# EAGLE design module (EAGLE 9.6.2)

## Sheet 1 of 3
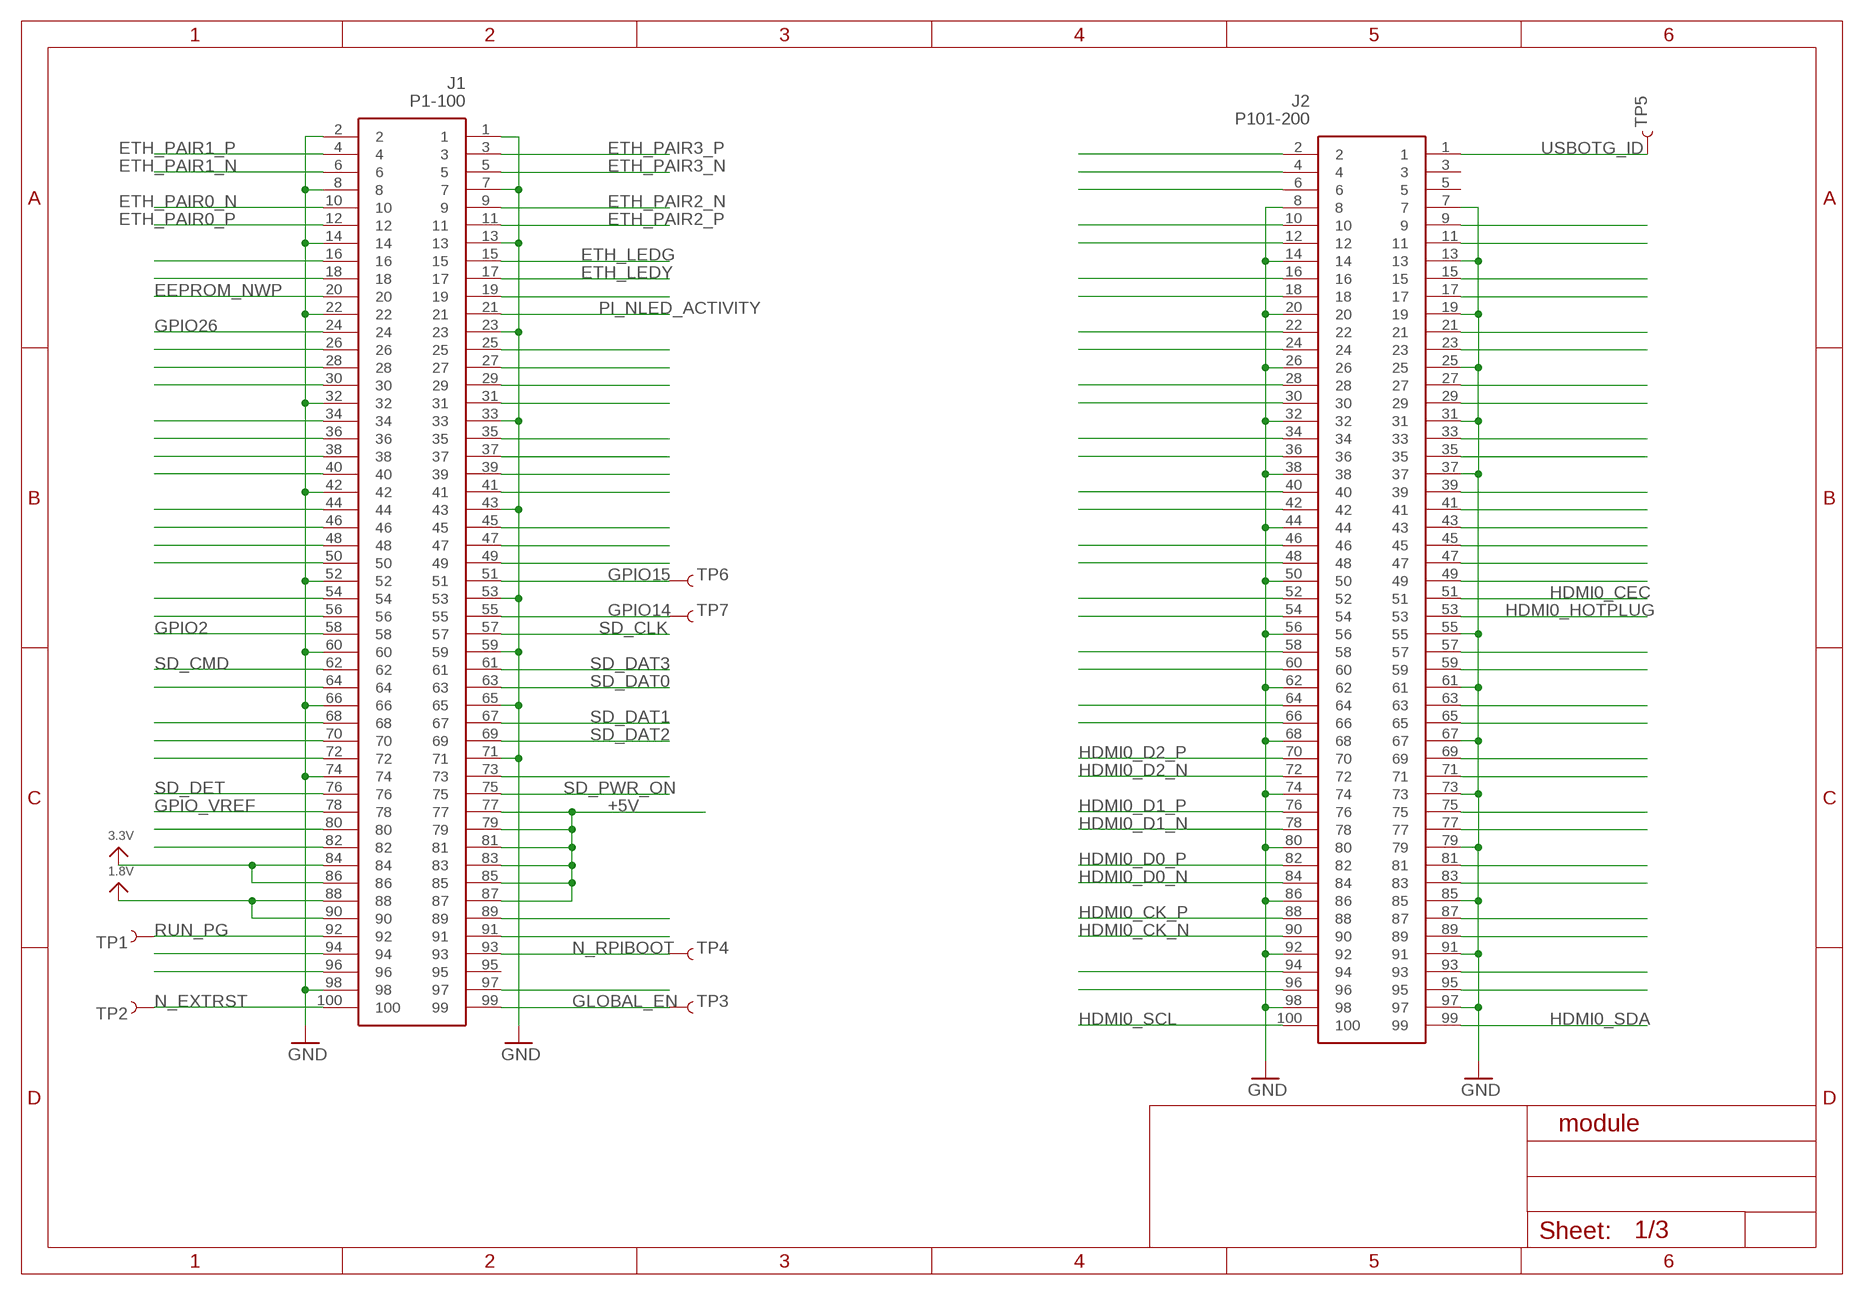
[diagram p0: schematic, sheet 1]

### Parts
J1  P1-100  DF40C-100DS-0.4V_51_  [DF40C100DS04V51]
J2  P101-200  DF40C-100DS-0.4V_51_  [DF40C100DS04V51]
TP1  TEST-POINT3X5  [PAD.03X.05]
TP2  TEST-POINT3X5  [PAD.03X.05]
TP3  TEST-POINT3X5  [PAD.03X.05]
TP4  TEST-POINT3X5  [PAD.03X.05]
TP5  TEST-POINT3X5  [PAD.03X.05]
TP6  TEST-POINT3X5  [PAD.03X.05]
TP7  TEST-POINT3X5  [PAD.03X.05]

### Nets
1.8V: J1.88 J1.90
3.3V: J1.84 J1.86
+5V: J1.77 J1.79 J1.81 J1.83 J1.85 J1.87
EEPROM_NWP: J1.20
ETH_LEDG: J1.15
ETH_LEDY: J1.17
ETH_PAIR0_N: J1.10
ETH_PAIR0_P: J1.12
ETH_PAIR1_N: J1.6
ETH_PAIR1_P: J1.4
ETH_PAIR2_N: J1.9
ETH_PAIR2_P: J1.11
ETH_PAIR3_N: J1.5
ETH_PAIR3_P: J1.3
GLOBAL_EN: J1.99 TP3.P$1
GND: J1.1 J1.2 J1.7 J1.8 J1.13 J1.14 J1.22 J1.23 J1.32 J1.33 J1.42 J1.43 J1.52 J1.53 J1.59 J1.60 J1.65 J1.66 J1.71 J1.74 J1.98 J2.7 J2.8 J2.13 J2.14 J2.19 J2.20 J2.25 J2.26 J2.31 J2.32 J2.37 J2.38 J2.44 J2.50 J2.55 J2.56 J2.61 J2.62 J2.67 J2.68 J2.73 J2.74 J2.79 J2.80 J2.85 J2.86 J2.91 J2.92 J2.97 J2.98
GPIO2: J1.58
GPIO14: J1.55 TP7.P$1
GPIO15: J1.51 TP6.P$1
GPIO26: J1.24
GPIO_VREF: J1.78
HDMI0_CEC: J2.51
HDMI0_CK_N: J2.90
HDMI0_CK_P: J2.88
HDMI0_D0_N: J2.84
HDMI0_D0_P: J2.82
HDMI0_D1_N: J2.78
HDMI0_D1_P: J2.76
HDMI0_D2_N: J2.72
HDMI0_D2_P: J2.70
HDMI0_HOTPLUG: J2.53
HDMI0_SCL: J2.100
HDMI0_SDA: J2.99
N$3: J2.2
N$5: J2.4
N$7: J2.6
N$10: J2.9
N$11: J2.10
N$12: J2.11
N$13: J2.12
N$16: J1.16
N$17: J2.15
N$18: J1.18
N$19: J1.19
N$20: J2.16
N$21: J2.17
N$22: J2.18
N$25: J1.25
N$26: J1.26
N$27: J1.27
N$28: J1.28
N$29: J1.29
N$30: J1.30
N$31: J1.31
N$32: J2.21
N$33: J2.22
N$34: J1.34
N$35: J1.35
N$36: J1.36
N$37: J1.37
N$38: J1.38
N$39: J1.39
N$40: J1.40
N$41: J1.41
N$42: J2.23
N$43: J2.24
N$44: J1.44
N$45: J1.45
N$46: J1.46
N$47: J1.47
N$48: J1.48
N$49: J1.49
N$50: J1.50
N$54: J1.54
N$56: J1.56
N$57: J2.27
N$58: J2.28
N$59: J2.29
N$60: J2.30
N$63: J2.33
N$64: J1.64
N$65: J2.34
N$66: J2.35
N$67: J2.36
N$68: J1.68
N$70: J1.70
N$72: J1.72
N$73: J1.73
N$74: J2.39
N$75: J2.40
N$76: J2.41
N$77: J2.42
N$78: J2.43
N$80: J1.80
N$81: J2.45
N$82: J1.82
N$83: J2.46
N$84: J2.47
N$85: J2.48
N$86: J2.49
N$89: J1.89
N$90: J2.52
N$91: J1.91
N$93: J2.54
N$94: J1.94
N$96: J1.96
N$97: J1.97
N$99: J2.57
N$100: J2.58
N$101: J2.59
N$102: J2.60
N$105: J2.63
N$106: J2.64
N$107: J2.65
N$108: J2.66
N$111: J2.69
N$113: J2.71
N$117: J2.75
N$119: J2.77
N$123: J2.81
N$125: J2.83
N$129: J2.87
N$131: J2.89
N$135: J2.93
N$136: J2.94
N$137: J2.95
N$138: J2.96
N_EXTRST: J1.100 TP2.P$1
N_RPIBOOT: J1.93 TP4.P$1
PI_NLED_ACTIVITY: J1.21
RUN_PG: J1.92 TP1.P$1
SD_CLK: J1.57
SD_CMD: J1.62
SD_DAT0: J1.63
SD_DAT1: J1.67
SD_DAT2: J1.69
SD_DAT3: J1.61
SD_DET: J1.76
SD_PWR_ON: J1.75
USBOTG_ID: J2.1 TP5.P$1
Unconnected: J1.95 J2.3 J2.5

## Sheet 2 of 3
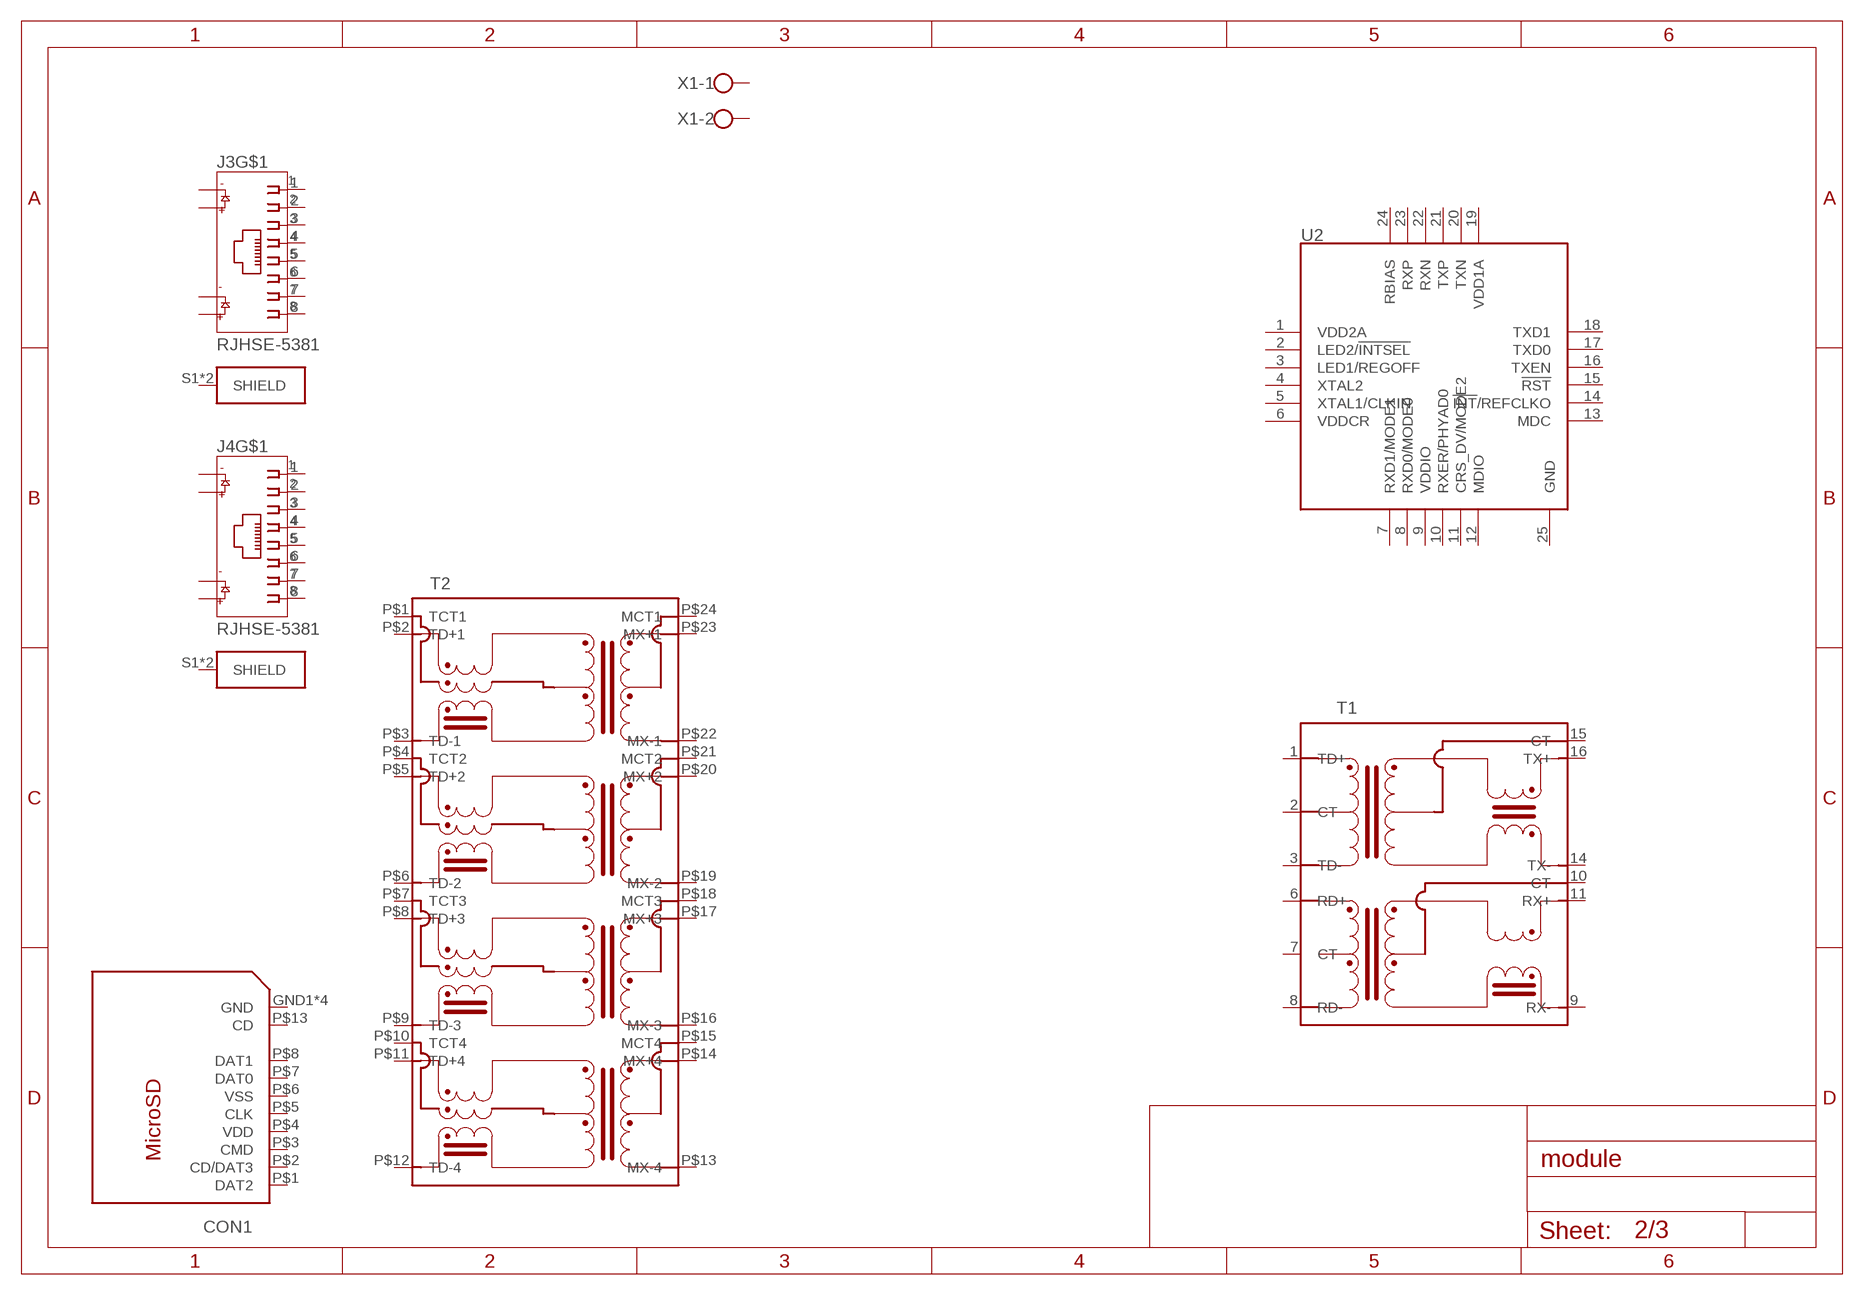
[diagram p1: schematic, sheet 2]

### Parts
CON1  112J-TXAR  [112J]
J3  RJHSE-5381  [AMPHENOL_RJHSE-5381]
J4  RJHSE-5381  [AMPHENOL_RJHSE-5381]
T1  PT61017PEL  [PT61017]
T2  SM51625  [SM61625EL]
U2  LAN8720A  [QFN50P400X400X100-25T250N]
X1  W237-102  [EBBA]
Unconnected: CON1.GND1(GND) CON1.GND2(GND) CON1.GND3(GND) CON1.GND4(GND) CON1.P$1(DAT2) CON1.P$2(CD/DAT3) CON1.P$3(CMD) CON1.P$4(VDD) CON1.P$5(CLK) CON1.P$6(VSS) CON1.P$7(DAT0) CON1.P$8(DAT1) CON1.P$13(CD) J3.1 J3.2 J3.3 J3.4 J3.5 J3.6 J3.7 J3.8 J3.9 J3.10 J3.11 J3.12 J3.S1(SHIELD) J3.S2(SHIELD) J4.1 J4.2 J4.3 J4.4 J4.5 J4.6 J4.7 J4.8 J4.9 J4.10 J4.11 J4.12 J4.S1(SHIELD) J4.S2(SHIELD) T1.1(TD+) T1.2(CT) T1.3(TD-) T1.6(RD+) T1.7(CT) T1.8(RD-) T1.9(RX-) T1.10(CT) T1.11(RX+) T1.14(TX-) T1.15(CT) T1.16(TX+) T2.P$1(TCT1) T2.P$2(TD+1) T2.P$3(TD-1) T2.P$4(TCT2) T2.P$5(TD+2) T2.P$6(TD-2) T2.P$7(TCT3) T2.P$8(TD+3) T2.P$9(TD-3) T2.P$10(TCT4) T2.P$11(TD+4) T2.P$12(TD-4) T2.P$13(MX-4) T2.P$14(MX+4) T2.P$15(MCT4) T2.P$16(MX-3) T2.P$17(MX+3) T2.P$18(MCT3) T2.P$19(MX-2) T2.P$20(MX+2) T2.P$21(MCT2) T2.P$22(MX-1) T2.P$23(MX+1) T2.P$24(MCT1) U2.1(VDD2A) U2.2(LED2/!INTSEL) U2.3(LED1/REGOFF) U2.4(XTAL2) U2.5(XTAL1/CLKIN) U2.6(VDDCR) U2.7(RXD1/MODE1) U2.8(RXD0/MODE0) U2.9(VDDIO) U2.10(RXER/PHYAD0) U2.11(CRS_DV/MODE2) U2.12(MDIO) U2.13(MDC) U2.14(!INT!/REFCLKO) U2.15(!RST) U2.16(TXEN) U2.17(TXD0) U2.18(TXD1) U2.19(VDD1A) U2.20(TXN) U2.21(TXP) U2.22(RXN) U2.23(RXP) U2.24(RBIAS) U2.25(GND) X1.1 X1.2

## Sheet 3 of 3
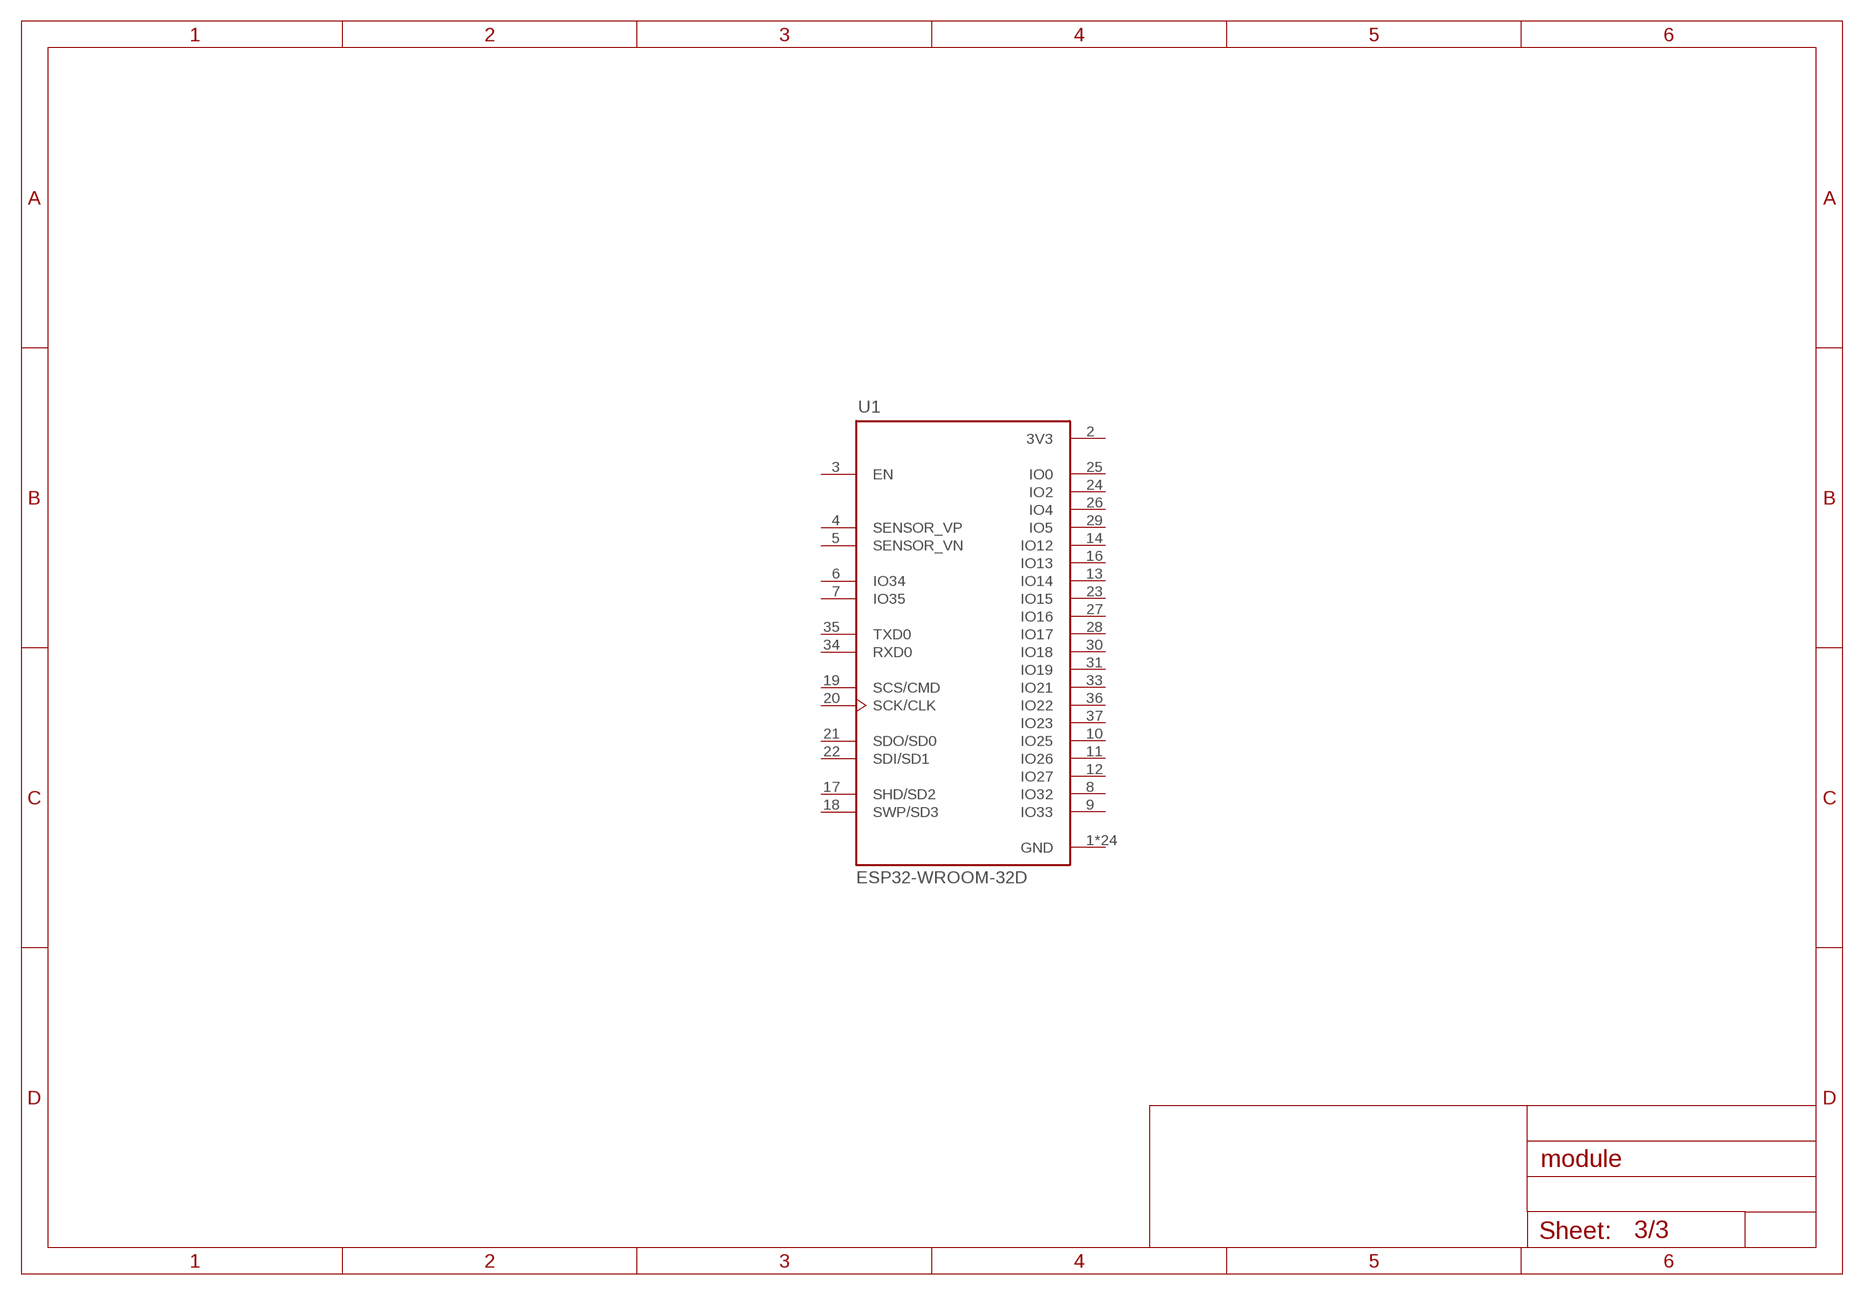
[diagram p2: schematic, sheet 3]

### Parts
U1  ESP32-WROOM-32D  [MODULE_ESP32-WROOM-32D]
Unconnected: U1.3(EN) U1.4(SENSOR_VP) U1.5(SENSOR_VN) U1.6(IO34) U1.7(IO35) U1.8(IO32) U1.9(IO33) U1.10(IO25) U1.11(IO26) U1.12(IO27) U1.13(IO14) U1.14(IO12) U1.16(IO13) U1.17(SHD/SD2) U1.18(SWP/SD3) U1.19(SCS/CMD) U1.20(SCK/CLK) U1.21(SDO/SD0) U1.22(SDI/SD1) U1.23(IO15) U1.24(IO2) U1.25(IO0) U1.26(IO4) U1.27(IO16) U1.28(IO17) U1.29(IO5) U1.30(IO18) U1.31(IO19) U1.33(IO21) U1.34(RXD0) U1.35(TXD0) U1.36(IO22) U1.37(IO23)

## Power pins joined to a net without a drawn wire
3V3: U1.2(3V3)
GND: U1.1(GND) U1.15(GND) U1.38(GND) U1.39_1(GND) U1.39_2(GND) U1.39_3(GND) U1.39_4(GND) U1.39_5(GND) U1.39_6(GND) U1.39_7(GND) U1.39_8(GND) U1.39_9(GND) U1.39_10(GND) U1.39_11(GND) U1.39_12(GND) U1.39_13(GND) U1.39_14(GND) U1.39_15(GND) U1.39_16(GND) U1.39_17(GND) U1.39_18(GND) U1.39_19(GND) U1.39_20(GND) U1.39_21(GND)

## Library data of the parts
CON1 = parts-attend:112J-TXAR
J1 J2 = SamacSys_Parts:DF40C-100DS-0.4V_51_: HIROSE(HRS) - DF40C-100DS-0.4V(51) - CONNECTOR, STACKING, RCPT, 100POS, 2ROW Source: Datasheet <https://www.hirose.com/product/en/download_file/key_name/DF40C-100DS-0.4V(51)/category/Drawing (2D)/doc_file_id/46856/?file_category_id=6&item_id=06844033451&is_series=>; DESCRIPTION: HIROSE(HRS) - DF40C-100DS-0.4V(51) - CONNECTOR, STACKING, RCPT, 100POS, 2ROW; HEIGHT: 1.65mm; MANUFACTURER_NAME: Hirose; MANUFACTURER_PART_NUMBER: DF40C-100DS-0.4V(51); MOUSER_PART_NUMBER: 798-DF40C100DS0.4V51; MOUSER_PRICE-STOCK: https://www.mouser.co.uk/ProductDetail/Hirose-Connector/DF40C-100DS-04V51?qs=eDUdFcBPps2MEwbnuPvZzQ%3D%3D
J3 J4 = parts-amphenol:RJHSE-5381: connector, mod jack, rt angle pcb, shielded, led1-g, led2-y, single port, rj-45 8 cont; AVAILABILITY: Unavailable; DESCRIPTION: connector, mod jack, rt angle pcb, shielded, led1-g, led2-y, single port, rj-45 8 cont; MF: Amphenol ICC; MP: RJHSE-5381; PACKAGE: None; PRICE: None
T1 = parts-bourns:PT61017PEL
T2 = parts-bourns:SM51625
TP1-TP7 = SparkFun-Connectors:TEST-POINT: SparkFun Test Points Bare copper test points for troubleshooting or In-Circuit-Testing. These are used by our Production team for verifying production board runs using pogo-pins on test beds. SparkFun Products: SparkFun LSM9DS1 Breakout <https://www.sparkfun.com/products/13284> SparkFun PSOC <https://www.sparkfun.com/products/13714> SparkFun Load Cell Amplifier <https://www.sparkfun.com/products/13879>
U1 = parts-espressif:ESP32-WROOM-32D: Bluetooth, WiFi 802.11b/g/n, Bluetooth v4.2 + EDR, Class 1, 2 and 3 Transceiver Module 2.4GHz ~ 2.5GHz Integrated, Trace Surface Mount Check prices <https://pricing.snapeda.com/parts/ESP32-WROOM-32D/Espressif%20Systems/view-part?ref=eda>; AVAILABILITY: Bad; DESCRIPTION: 802.11b/g/n, Bluetooth v4.2 +EDR, Class 1, 2 and 3 Transceiver Module 2.4GHz ~ 2.5GHz Integrated, Trace Surface Mount; MF: Espressif Systems; MP: ESP32-WROOM-32D; PACKAGE: Module Espressif Systems; PRICE: None
U2 = parts-microchip:LAN8720A
X1 = parts-adam_tech:W237-102: WAGO SCREW CLAMP

## Board
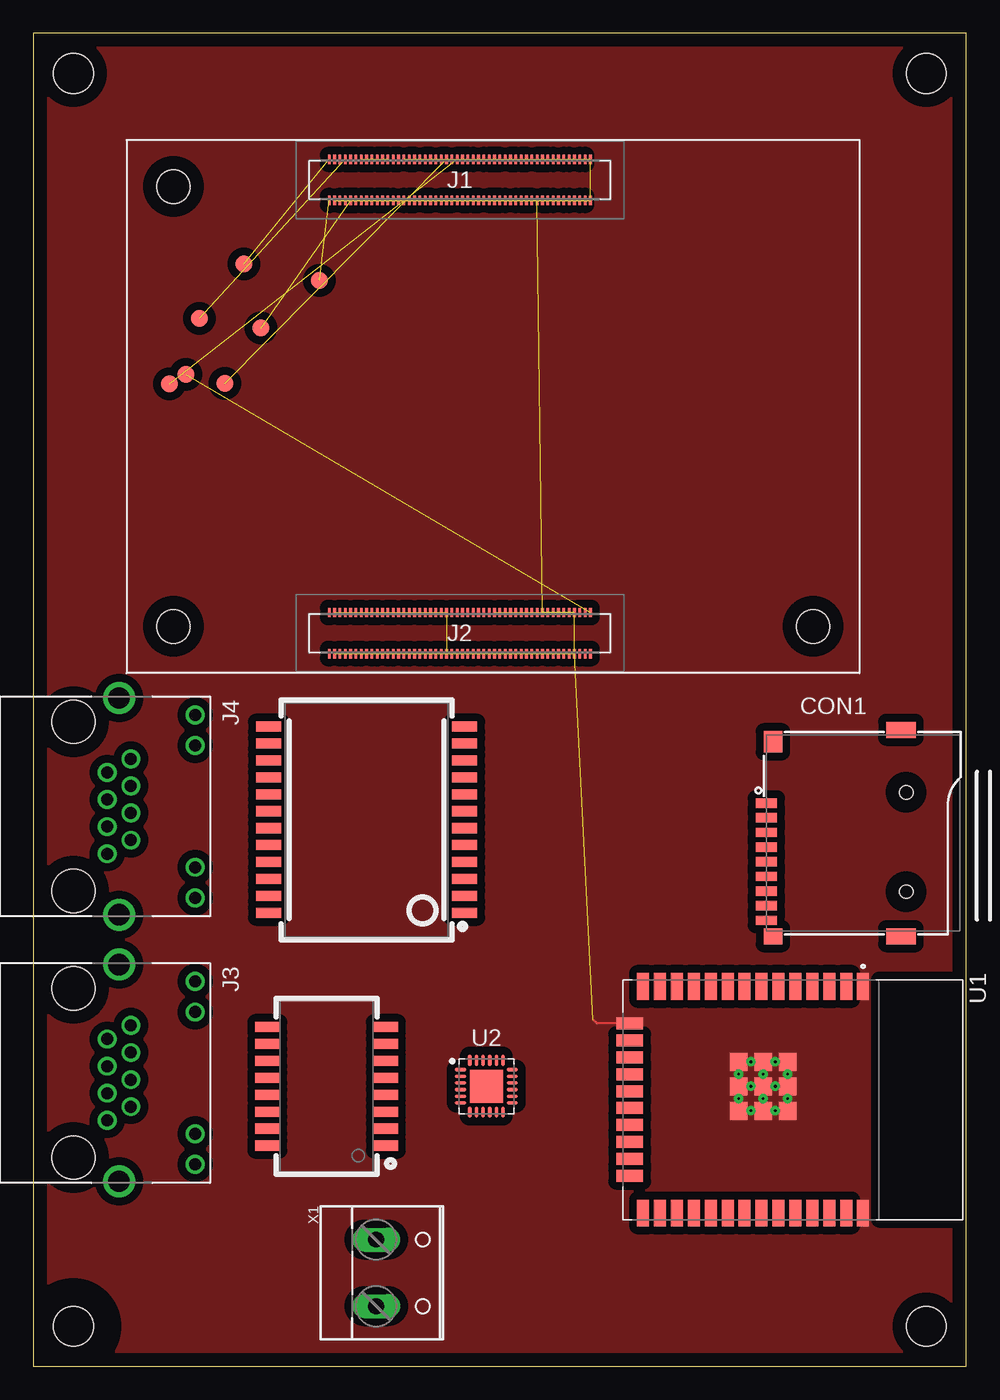
[diagram p3: board, top side]

Size 70 x 100 mm. Coordinates in mm from the lower left corner, seen from the top.
Outline: 0,0 70,0 70,100 0,100 0,0
Copper layers (1*16): Top 0.035mm / dielectric 1.5mm / Bottom 0.035mm
Design rules "default": minimum track width 6mil, minimum drill 0.35mm, track to track 6mil, track to pad 6mil, pad to pad 6mil, via to via 6mil, smd to smd 6mil, copper to edge 40mil, drill to drill 6mil, minimum pad ring 10mil, minimum via ring 8mil, stop-mask expansion 4mil, vias tented up to drill 0mil, thermal gap 10mil
Holes 2.5 mm at 10.5,55.5 10.5,88.5 58.5,55.5
Holes 3 mm at 3,3 3,97 67,3 67,97
tRestrict: area 0,0 to 6,6

### Footprints (pad centres in the part's own frame; a part is rotated, then mirrored left to right if it is on the bottom)
112J = smd 1.2 x 1.4: GND1 -7.75,-0.5 | smd 1.2 x 2.2: GND2 -7.75,-10.1; GND3 7.75,-10.1 | smd 1.6 x 1.4: GND4 6.85,-0.5 | smd 0.7 x 1.6: P$1 2.25,0; P$2 1.15,0; P$3 0.05,0; P$4 -1.05,0; P$5 -2.15,0; P$6 -3.25,0; P$7 -4.35,0; P$8 -5.45,0; P$13 -6.55,0 | hole 1: -4.4,-10.5; 3.05,-10.5
DF40C100DS04V51 = smd 0.2 x 0.7: 1 -9.8,-1.54; 2 -9.8,1.54; 3 -9.4,-1.54; 4 -9.4,1.54; 5 -9,-1.54; 6 -9,1.54; 7 -8.6,-1.54; 8 -8.6,1.54; 9 -8.2,-1.54; 10 -8.2,1.54; 11 -7.8,-1.54; 12 -7.8,1.54; 13 -7.4,-1.54; 14 -7.4,1.54; 15 -7,-1.54; 16 -7,1.54; 17 -6.6,-1.54; 18 -6.6,1.54; 19 -6.2,-1.54; 20 -6.2,1.54; 21 -5.8,-1.54; 22 -5.8,1.54; 23 -5.4,-1.54; 24 -5.4,1.54; 25 -5,-1.54; 26 -5,1.54; 27 -4.6,-1.54; 28 -4.6,1.54; 29 -4.2,-1.54; 30 -4.2,1.54; 31 -3.8,-1.54; 32 -3.8,1.54; 33 -3.4,-1.54; 34 -3.4,1.54; 35 -3,-1.54; 36 -3,1.54; 37 -2.6,-1.54; 38 -2.6,1.54; 39 -2.2,-1.54; 40 -2.2,1.54; 41 -1.8,-1.54; 42 -1.8,1.54; 43 -1.4,-1.54; 44 -1.4,1.54; 45 -1,-1.54; 46 -1,1.54; 47 -0.6,-1.54; 48 -0.6,1.54; 49 -0.2,-1.54; 50 -0.2,1.54; 51 0.2,-1.54; 52 0.2,1.54; 53 0.6,-1.54; 54 0.6,1.54; 55 1,-1.54; 56 1,1.54; 57 1.4,-1.54; 58 1.4,1.54; 59 1.8,-1.54; 60 1.8,1.54; 61 2.2,-1.54; 62 2.2,1.54; 63 2.6,-1.54; 64 2.6,1.54; 65 3,-1.54; 66 3,1.54; 67 3.4,-1.54; 68 3.4,1.54; 69 3.8,-1.54; 70 3.8,1.54; 71 4.2,-1.54; 72 4.2,1.54; 73 4.6,-1.54; 74 4.6,1.54; 75 5,-1.54; 76 5,1.54; 77 5.4,-1.54; 78 5.4,1.54; 79 5.8,-1.54; 80 5.8,1.54; 81 6.2,-1.54; 82 6.2,1.54; 83 6.6,-1.54; 84 6.6,1.54; 85 7,-1.54; 86 7,1.54; 87 7.4,-1.54; 88 7.4,1.54; 89 7.8,-1.54; 90 7.8,1.54; 91 8.2,-1.54; 92 8.2,1.54; 93 8.6,-1.54; 94 8.6,1.54; 95 9,-1.54; 96 9,1.54; 97 9.4,-1.54; 98 9.4,1.54; 99 9.8,-1.54; 100 9.8,1.54
AMPHENOL_RJHSE-5381 = drill 0.9: 1 3.55,2.54; 2 2.53,4.32; 3 1.52,2.54; 4 0.5,4.32; 5 -0.51,2.54; 6 -1.53,4.32; 7 -2.54,2.54; 8 -3.56,4.32; 9 6.86,9.14; 10 4.57,9.14; 11 -4.57,9.14; 12 -6.86,9.14 | drill 1.6: S1 8.13,3.43; S2 -8.13,3.43 | hole 3.25: 6.35,0; -6.35,0
PT61017 = smd 0.76 x 1.8: 1 -4.445,-4.45; 2 -3.175,-4.45; 3 -1.905,-4.45; 4 -0.635,-4.45; 5 0.635,-4.45; 6 1.905,-4.45; 7 3.175,-4.45; 8 4.445,-4.45; 9 4.445,4.45; 10 3.175,4.45; 11 1.905,4.45; 12 0.635,4.45; 13 -0.635,4.45; 14 -1.905,4.45; 15 -3.175,4.45; 16 -4.445,4.45
SM61625EL = smd 0.76 x 1.9: P$1 -6.985,-7.35; P$2 -5.715,-7.35; P$3 -4.445,-7.35; P$4 -3.175,-7.35; P$5 -1.905,-7.35; P$6 -0.635,-7.35; P$7 0.635,-7.35; P$8 1.905,-7.35; P$9 3.175,-7.35; P$10 4.445,-7.35; P$11 5.715,-7.35; P$12 6.985,-7.35; P$13 6.985,7.35; P$14 5.715,7.35; P$15 4.445,7.35; P$16 3.175,7.35; P$17 1.905,7.35; P$18 0.635,7.35; P$19 -0.635,7.35; P$20 -1.905,7.35; P$21 -3.175,7.35; P$22 -4.445,7.35; P$23 -5.715,7.35; P$24 -6.985,7.35
PAD.03X.05 = smd 1.27 x 1.27: P$1 0,0
MODULE_ESP32-WROOM-32D = smd 2 x 0.9: 1 -8.5,5.26; 2 -8.5,3.99; 3 -8.5,2.72; 4 -8.5,1.45; 5 -8.5,0.18; 6 -8.5,-1.09; 7 -8.5,-2.36; 8 -8.5,-3.63; 9 -8.5,-4.9; 10 -8.5,-6.17; 11 -8.5,-7.44; 12 -8.5,-8.71; 13 -8.5,-9.98; 14 -8.5,-11.25; 25 8.5,-11.25; 26 8.5,-9.98; 27 8.5,-8.71; 28 8.5,-7.44; 29 8.5,-6.17; 30 8.5,-4.9; 31 8.5,-3.63; 32 8.5,-2.36; 33 8.5,-1.09; 34 8.5,0.18; 35 8.5,1.45; 36 8.5,2.72; 37 8.5,3.99; 38 8.5,5.26 | smd 0.9 x 2: 15 -5.715,-12.25; 16 -4.445,-12.25; 17 -3.175,-12.25; 18 -1.905,-12.25; 19 -0.635,-12.25; 20 0.635,-12.25; 21 1.905,-12.25; 22 3.175,-12.25; 23 4.445,-12.25; 24 5.715,-12.25 | smd 1.33 x 1.33: 39_1 -2.835,-0.405; 39_2 -1,-0.405; 39_3 0.835,-0.405; 39_4 -2.835,-2.24; 39_5 -1,-2.24; 39_6 0.835,-2.24; 39_7 -2.835,-4.075; 39_8 -1,-4.075; 39_9 0.835,-4.075 | drill 0.2 pad 0.3: 39_10 -1.917,-0.405; 39_11 -0.083,-0.405; 39_12 -2.835,-1.323; 39_13 -1,-1.323; 39_14 0.835,-1.323; 39_15 -1.917,-2.24; 39_16 -0.083,-2.24; 39_17 -2.835,-3.158; 39_18 -1,-3.158; 39_19 0.835,-3.158; 39_20 -1.917,-4.075; 39_21 -0.083,-4.075
QFN50P400X400X100-25T250N = smd 0.838 x 0.264: 1 -1.946,1.25; 2 -1.946,0.75; 3 -1.946,0.25; 4 -1.946,-0.25; 5 -1.946,-0.75; 6 -1.946,-1.25; 13 1.946,-1.25; 14 1.946,-0.75; 15 1.946,-0.25; 16 1.946,0.25; 17 1.946,0.75; 18 1.946,1.25 | smd 0.264 x 0.838: 7 -1.25,-1.946; 8 -0.75,-1.946; 9 -0.25,-1.946; 10 0.25,-1.946; 11 0.75,-1.946; 12 1.25,-1.946; 19 1.25,1.946; 20 0.75,1.946; 21 0.25,1.946; 22 -0.25,1.946; 23 -0.75,1.946; 24 -1.25,1.946 | smd 2.5 x 2.5: 25 0,0
EBBA = drill 1.194 long: 1 -2.5,-1.27; 2 2.5,-1.27

### Placement (x,y rotation side)
CON1  55,40 90 top
J1  32,89 180 top
J2  32,55 180 top
J3  3,22 270 top
J4  3,42 270 top
T1  22,21 90 top
T2  25,41 90 top
TP1  17.08,77.89 0 top
TP2  21.47,81.47 90 top
TP3  15.79,82.69 0 top
TP4  12.47,78.62 0 top
TP5  11.46,74.4 90 top
TP6  10.21,73.71 90 top
TP7  14.36,73.73 0 top
U1  57,20 270 top
U2  34,21 0 top
X1  27,7 270 top

### Tracks (layer width: path | path; a pad name or v marks a point on that pad's centre or on a via)
1.8V  (1 unrouted)
3.3V  (1 unrouted)
+5V  (5 unrouted)
GLOBAL_EN  (1 unrouted)
GND  (51 unrouted)
  Top 0.152: U1.15 42.28,25.71 42,26
  pour Top (isolate 0.6, rank 6, no thermals): -1,101 71,101 71,-1 -1,-1
GPIO14  (1 unrouted)
GPIO15  (1 unrouted)
N_EXTRST  (1 unrouted)
N_RPIBOOT  (1 unrouted)
RUN_PG  (1 unrouted)
USBOTG_ID  (1 unrouted)